# EAGLE schematic Development Board ATMega32 (EAGLE 7.6.0)

## Sheet 1 of 2
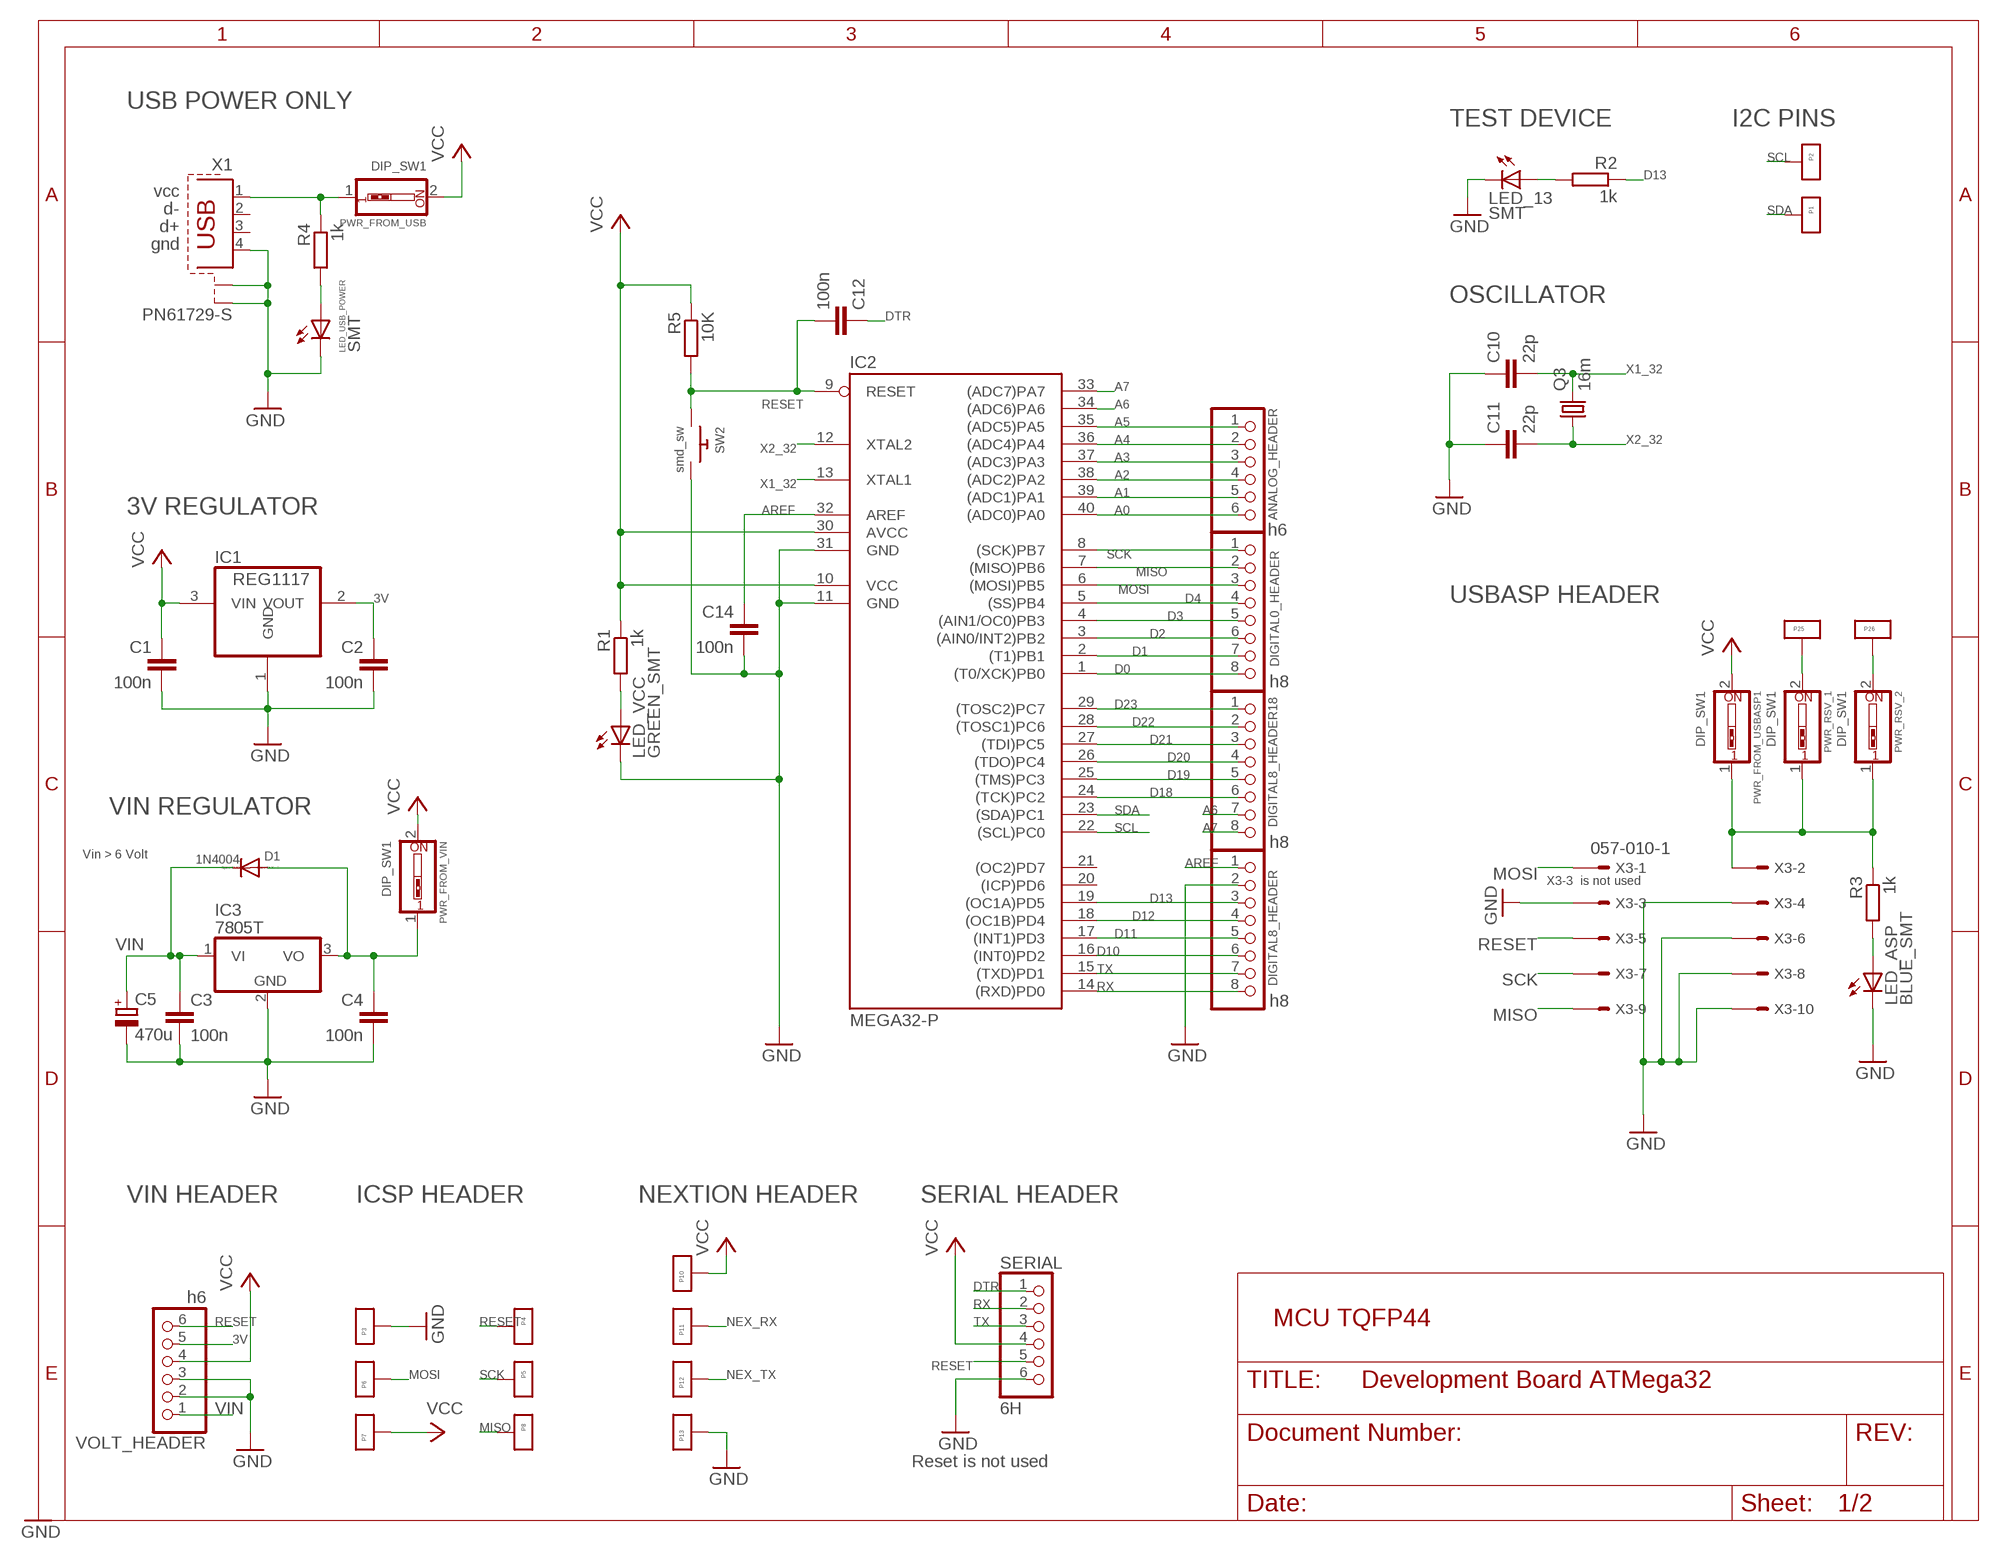
[diagram p0: schematic, sheet 1]

### Parts
ANALOG_HEADER  h6  PINHD-1X6  [1X06]
C1  100n  C-EUC1206  [C1206]
C2  100n  C-EUC1206  [C1206]
C3  100n  C-EU050-025X075  [C050-025X075]
C4  100n  C-EU050-025X075  [C050-025X075]
C5  470u  CPOL-EUE5-5  [E5-5]
C10  22p  C-EUC1206  [C1206]
C11  22p  C-EUC1206  [C1206]
C12  100n  C-EUC1206  [C1206]
C14  100n  C-EUC1206  [C1206]
D1  1N4004  [DO41-10]
DIGITAL0_HEADER  h8  PINHD-1X8BIG  [1X08-BIG]
DIGITAL8_HEADER  h8  PINHD-1X8BIG  [1X08-BIG]
DIGITAL8_HEADER18  h8  PINHD-1X8BIG  [1X08-BIG]
IC1  REG1117  [SOT223]
IC2  MEGA32-P  [DIL40]
IC3  7805T  [TO220H]
LED_13  SMT  LEDSMT1206  [1206]
LED_ASP  BLUE_SMT  LEDSMT1206  [1206]
LED_USB_POWER  SMT  LEDSMT1206  [1206]
LED_VCC  GREEN_SMT  LEDSMT1206  [1206]
P1  PIN-BIG1X  [PIN-BIG]
P2  PIN-BIG1X  [PIN-BIG]
P3  PIN-BIG1X  [PIN-BIG]
P4  PIN-BIG1X  [PIN-BIG]
P5  PIN-BIG1X  [PIN-BIG]
P6  PIN-BIG1X  [PIN-BIG]
P7  PIN-BIG1X  [PIN-BIG]
P8  PIN-BIG1X  [PIN-BIG]
P10  PIN-BIG1X  [PIN-BIG]
P11  PIN-BIG1X  [PIN-BIG]
P12  PIN-BIG1X  [PIN-BIG]
P13  PIN-BIG1X  [PIN-BIG]
P25  PIN-BIG1X  [PIN-BIG]
P26  PIN-BIG1X  [PIN-BIG]
PWR_FROM_USB  DIP_SW1  SW_DIP-1  [EDG-01]
PWR_FROM_USBASP1  DIP_SW1  SW_DIP-1  [EDG-01]
PWR_FROM_VIN  DIP_SW1  SW_DIP-1  [EDG-01]
PWR_RSV_1  DIP_SW1  SW_DIP-1  [EDG-01]
PWR_RSV_2  DIP_SW1  SW_DIP-1  [EDG-01]
Q3  16m  CRYSTALHC49UP  [HC49UP]
R1  1k  R-EU_R1206  [R1206]
R2  1k  R-EU_R1206  [R1206]
R3  1k  R-EU_R1206  [R1206]
R4  1k  R-EU_R1206  [R1206]
R5  10K  R-EU_R1206  [R1206]
SERIAL  6H  PINHD-1X6  [1X06]
SW2  smd_sw  SWITCH_PUSHBUTTONEVQ-PE  [TACT_PANA-EVQ]
VOLT_HEADER  h6  PINHD-1X6  [1X06]
X1  PN61729-S  [PN61729-S]
X3  057-010-1  [057-010-1]

### Nets
3V: C2.1 IC1.2(VOUT) VOLT_HEADER.5
A0: ANALOG_HEADER.6 IC2.40((ADC0)PA0)
A1: ANALOG_HEADER.5 IC2.39((ADC1)PA1)
A2: ANALOG_HEADER.4 IC2.38((ADC2)PA2)
A3: ANALOG_HEADER.3 IC2.37((ADC3)PA3)
A4: ANALOG_HEADER.2 IC2.36((ADC4)PA4)
A5: ANALOG_HEADER.1 IC2.35((ADC5)PA5)
A6: DIGITAL8_HEADER18.7 IC2.34((ADC6)PA6)
A7: DIGITAL8_HEADER18.8 IC2.33((ADC7)PA7)
AREF: C14.1 DIGITAL8_HEADER.1 IC2.32(AREF)
D0: DIGITAL0_HEADER.8 IC2.1((T0/XCK)PB0)
D1: DIGITAL0_HEADER.7 IC2.2((T1)PB1)
D2: DIGITAL0_HEADER.6 IC2.3((AIN0/INT2)PB2)
D3: DIGITAL0_HEADER.5 IC2.4((AIN1/OC0)PB3)
D4: DIGITAL0_HEADER.4 IC2.5((SS)PB4)
D10: DIGITAL8_HEADER.6 IC2.16((INT0)PD2)
D11: DIGITAL8_HEADER.5 IC2.17((INT1)PD3)
D12: DIGITAL8_HEADER.4 IC2.18((OC1B)PD4)
D13: DIGITAL8_HEADER.3 IC2.19((OC1A)PD5) R2.1
D18: DIGITAL8_HEADER18.6 IC2.24((TCK)PC2)
D19: DIGITAL8_HEADER18.5 IC2.25((TMS)PC3)
D20: DIGITAL8_HEADER18.4 IC2.26((TDO)PC4)
D21: DIGITAL8_HEADER18.3 IC2.27((TDI)PC5)
D22: DIGITAL8_HEADER18.2 IC2.28((TOSC1)PC6)
D23: DIGITAL8_HEADER18.1 IC2.29((TOSC2)PC7)
DTR: C12.1 SERIAL.1
GND: C1.2 C2.2 C3.2 C4.2 C5.- C10.1 C11.1 C14.2 DIGITAL8_HEADER.2 IC1.1(GND) IC2.11(GND) IC2.31(GND) IC3.2(GND) LED_13.C LED_ASP.C LED_USB_POWER.C LED_VCC.C P3.P$1 P13.P$1 SERIAL.6 SW2.P$2 VOLT_HEADER.2 VOLT_HEADER.3 X1.4 X1.S1 X1.S2 X3.3 X3.4 X3.6 X3.8 X3.10 ; also sheet 2
MISO: DIGITAL0_HEADER.2 IC2.7((MISO)PB6) P8.P$1 X3.9
MOSI: DIGITAL0_HEADER.3 IC2.6((MOSI)PB5) P6.P$1 X3.1
N$1: LED_VCC.A R1.2
N$2: LED_13.A R2.2
N$3: LED_ASP.A R3.2
N$4: PWR_FROM_USB.1 R4.1 X1.1
N$5: LED_USB_POWER.A R4.2
N$6: C4.1 D1.A IC3.3(VO) PWR_FROM_VIN.1
N$60: PWR_FROM_USBASP1.1 PWR_RSV_1.1 PWR_RSV_2.1 R3.1 X3.2
NEX_RX: P11.P$1 ; also sheet 2
NEX_TX: P12.P$1 ; also sheet 2
RESET: C12.2 IC2.9(RESET) P4.P$1 R5.2 SERIAL.5 SW2.P$1 VOLT_HEADER.6 X3.5
RSV1: P25.P$1 PWR_RSV_1.2
RSV2: P26.P$1 PWR_RSV_2.2
RX: DIGITAL8_HEADER.8 IC2.14((RXD)PD0) SERIAL.2
SCK: DIGITAL0_HEADER.1 IC2.8((SCK)PB7) P5.P$1 X3.7
SCL: IC2.22((SCL)PC0) P2.P$1
SDA: IC2.23((SDA)PC1) P1.P$1
TX: DIGITAL8_HEADER.7 IC2.15((TXD)PD1) SERIAL.3
VCC: C1.1 IC1.3(VIN) IC2.10(VCC) IC2.30(AVCC) P7.P$1 P10.P$1 PWR_FROM_USB.2 PWR_FROM_USBASP1.2 PWR_FROM_VIN.2 R1.1 R5.1 SERIAL.4 VOLT_HEADER.4 ; also sheet 2
VIN: C3.1 C5.+ D1.C IC3.1(VI) VOLT_HEADER.1
X1_32: C10.2 IC2.13(XTAL1) Q3.2
X2_32: C11.2 IC2.12(XTAL2) Q3.1
Unconnected: IC2.20((ICP)PD6) IC2.21((OC2)PD7) X1.2 X1.3

### Notes on the sheet
- USB POWER ONLY
- TEST DEVICE | I2C PINS
- vcc
- d-
- d+
- gnd
- OSCILLATOR
- 3V REGULATOR
- USBASP HEADER
- VIN REGULATOR
- Vin > 6 Volt
- X3-3  is not used
- VIN HEADER | ICSP HEADER | NEXTION HEADER | SERIAL HEADER
- MCU TQFP44
- Reset is not used

## Sheet 2 of 2
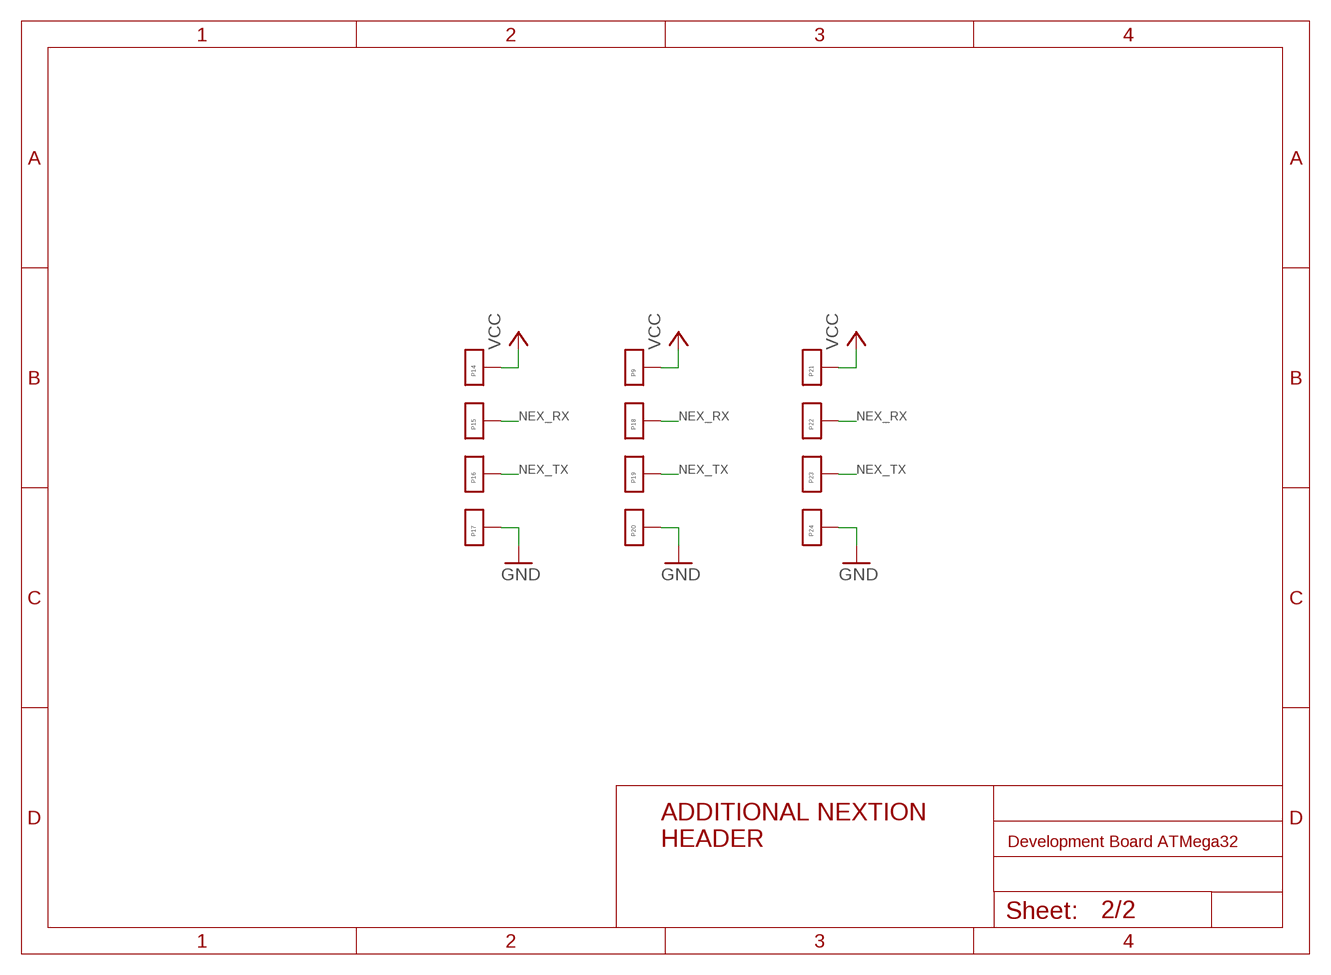
[diagram p1: schematic, sheet 2]

### Parts
P9  PIN-BIG1X  [PIN-BIG]
P14  PIN-BIG1X  [PIN-BIG]
P15  PIN-BIG1X  [PIN-BIG]
P16  PIN-BIG1X  [PIN-BIG]
P17  PIN-BIG1X  [PIN-BIG]
P18  PIN-BIG1X  [PIN-BIG]
P19  PIN-BIG1X  [PIN-BIG]
P20  PIN-BIG1X  [PIN-BIG]
P21  PIN-BIG1X  [PIN-BIG]
P22  PIN-BIG1X  [PIN-BIG]
P23  PIN-BIG1X  [PIN-BIG]
P24  PIN-BIG1X  [PIN-BIG]

### Nets
GND: P17.P$1 P20.P$1 P24.P$1 ; also sheet 1
NEX_RX: P15.P$1 P18.P$1 P22.P$1 ; also sheet 1
NEX_TX: P16.P$1 P19.P$1 P23.P$1 ; also sheet 1
VCC: P9.P$1 P14.P$1 P21.P$1 ; also sheet 1

### Notes on the sheet
- ADDITIONAL NEXTION 
  HEADER

## Library data of the parts
ANALOG_HEADER SERIAL VOLT_HEADER = adafruit:PINHD-1X6: PIN HEADER
C1-C4 C10-C12 C14 = resistor:C-EU: CAPACITOR, European symbol
C5 = resistor:CPOL-EU: POLARIZED CAPACITOR, European symbol
D1 = diode:1N4004: DIODE general purpose rectifier, 1 A
DIGITAL0_HEADER DIGITAL8_HEADER DIGITAL8_HEADER18 = adafruit:PINHD-1X8: PIN HEADER
IC1 = burr-brown:REG1117: 800mA and 1A Low Dropout (LDO) Positive Regulator 1.8V, 2.5V, 2.85V, 3.3V, 5V, and Adj; MPN: REG1117; OC_FARNELL: 1097566; OC_NEWARK: 14P6981
IC2 = atmel:MEGA32-P: MICROCONTROLLER 32 Kbytes FLASH 2 Kbytes SRAM 1 Kbytes EEPROM USART 8-channel 10 bit ADC Source: www.atmel.com .. doc2503.pdf; MPN: ATMEGA32-16PU; OC_FARNELL: 1661729; OC_NEWARK: 51P1794
IC3 = adafruit:78*: Positive VOLTAGE REGULATOR Added bigger pads to the TO-92 package
LED_13 LED_ASP LED_USB_POWER LED_VCC = adafruit:LED: LED OSRAM: - CHIPLED LG R971, LG N971, LY N971, LG Q971, LY Q971, LO R971, LY R971 LH N974, LH R974 LS Q976, LO Q976, LY Q976 LO Q996 - Hyper CHIPLED LW Q18S LB Q993, LB Q99A, LB R99A - SideLED LS A670, LO A670, LY A670, LG A670, LP A670 LB A673, LV A673, LT A673, LW A673 LH A674 LY A675 LS A676, LA A676, LO A676, LY A676, LW A676 LS A679, LY A679, LG A679 - Hyper Micro SIDELED® LS Y876, LA Y876, LO Y876, LY Y876 LT Y87S - SmartLED LW L88C, LW L88S LB L89C, LB L89S, LG L890 LS L89K, LO L89K, LY L89K LS L896, LA L896, LO L896, LY L896 - TOPLED LS T670, LO T670, LY T670, LG T670, LP T670 LSG T670, LSP T670, LSY T670, LOP T670, LYG T670 LG T671, LOG T671, LSG T671 LB T673, LV T673, LT T673, LW T673 LH T674 LS T676, LA T676, LO T676, LY T676, LB T676, LH T676, LSB T676, LW T676 LB T67C, LV T67C, LT T67C, LS T67K, LO T67K, LY T67K, LW E67C LS E67B, LA E67B, LO E67B, LY E67B, LB E67C, LV E67C, LT E67C LW T67C LS T679, LY T679, LG T679 LS T770, LO T770, LY T770, LG T770, LP T770 LB T773, LV T773, LT T773, LW T773 LH T774 LS E675, LA E675, LY E675, LS T675 LS T776, LA T776, LO T776, LY T776, LB T776 LHGB T686 LT T68C, LB T68C - Hyper Mini TOPLED® LB M676 - Mini TOPLED Santana® LG M470 LS M47K, LO M47K, LY M47K Source: http://www.osram.convergy.de/
P1-P26 = ioshub:PIN-BIG: 1X 1.0 mm pin big
PWR_FROM_USB PWR_FROM_USBASP1 PWR_FROM_VIN PWR_RSV_1 PWR_RSV_2 = special:SW_DIP-1: DIP SWITCH
Q3 = adafruit:CRYSTAL: CRYSTAL; OC_FARNELL: unknown; OC_NEWARK: unknown
R1-R5 = resistor:R-EU_: RESISTOR, European symbol
SW2 = adafruit:SWITCH_PUSHBUTTON: Buttons SOFTTOUCHSMD_SJ - Soft touch temporary push button (Super Junk Akihabara) Compatible with SKPMANE010 [Mouser: 688-SKPMAN] C&K_KSS = Digikey: KSS221GLFS
X1 = con-berg:PN61729-S: BERG USB connector; OC_FARNELL: unknown; OC_NEWARK: unknown
X3 = con-panduit:057-010-: CONNECTOR 10-pin series 057 contact pc board low profile headers; OC_FARNELL: unknown; OC_NEWARK: unknown